# Altium project v7-9B-Bump.PrjPcb
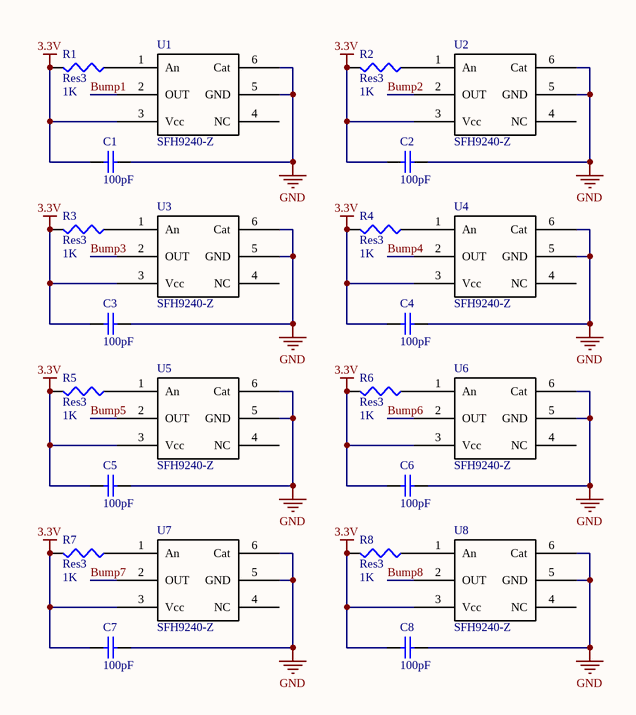
[diagram p0: Sensors.SchDoc]
4 sheets, 70 parts. Net scope: global (net labels, ports and power ports of the same name join across sheets).
Board file: v7-9B-Bump.PcbDoc
Sheets:
  Sensors.SchDoc
  motorEncoder.SchDoc
  Header.SchDoc
  LineCliffSensors.SchDoc

## Sheet Sensors.SchDoc
size A

### Parts
C1  value 100pF  [CAPC1005L]  (hidden comment: Cap Semi)
C2  value 100pF  [CAPC1005L]  (hidden comment: Cap Semi)
C3  value 100pF  [CAPC1005L]  (hidden comment: Cap Semi)
C4  value 100pF  [CAPC1005L]  (hidden comment: Cap Semi)
C5  value 100pF  [CAPC1005L]  (hidden comment: Cap Semi)
C6  value 100pF  [CAPC1005L]  (hidden comment: Cap Semi)
C7  value 100pF  [CAPC1005L]  (hidden comment: Cap Semi)
C8  value 100pF  [CAPC1005L]  (hidden comment: Cap Semi)
R1  Res3  value 1K  [RESC1608L]
R2  Res3  value 1K  [RESC1608L]
R3  Res3  value 1K  [RESC1608L]
R4  Res3  value 1K  [RESC1608L]
R5  Res3  value 1K  [RESC1608L]
R6  Res3  value 1K  [RESC1608L]
R7  Res3  value 1K  [RESC1608L]
R8  Res3  value 1K  [RESC1608L]
U1  SFH9240-Z  [SFH9240-Z]
U2  SFH9240-Z  [SFH9240-Z]
U3  SFH9240-Z  [SFH9240-Z]
U4  SFH9240-Z  [SFH9240-Z]
U5  SFH9240-Z  [SFH9240-Z]
U6  SFH9240-Z  [SFH9240-Z]
U7  SFH9240-Z  [SFH9240-Z]
U8  SFH9240-Z  [SFH9240-Z]

### Nets
3.3V: C1.2 C2.2 C3.2 C4.2 C5.2 C6.2 C7.2 C8.2 R1.2 R2.2 R3.2 R4.2 R5.2 R6.2 R7.2 R8.2 U1.3(Vcc) U2.3(Vcc) U3.3(Vcc) U4.3(Vcc) U5.3(Vcc) U6.3(Vcc) U7.3(Vcc) U8.3(Vcc)
GND: C1.1 C2.1 C3.1 C4.1 C5.1 C6.1 C7.1 C8.1 U1.5(GND) U1.6(Cat) U2.5(GND) U2.6(Cat) U3.5(GND) U3.6(Cat) U4.5(GND) U4.6(Cat) U5.5(GND) U5.6(Cat) U6.5(GND) U6.6(Cat) U7.5(GND) U7.6(Cat) U8.5(GND) U8.6(Cat)
Bump1: U1.2(OUT)
Bump2: U2.2(OUT)
Bump3: U3.2(OUT)
Bump4: U4.2(OUT)
Bump5: U5.2(OUT)
Bump6: U6.2(OUT)
Bump7: U7.2(OUT)
Bump8: U8.2(OUT)
NetR1_1: R1.1 U1.1(An)
NetR2_1: R2.1 U2.1(An)
NetR3_1: R3.1 U3.1(An)
NetR4_1: R4.1 U4.1(An)
NetR5_1: R5.1 U5.1(An)
NetR6_1: R6.1 U6.1(An)
NetR7_1: R7.1 U7.1(An)
NetR8_1: R8.1 U8.1(An)

Not connected (* = marked no-connect by the designer): U1 4(NC); U2 4(NC); U3 4(NC); U4 4(NC); U5 4(NC); U6 4(NC); U7 4(NC); U8 4(NC)

### Library data of the parts
C1-C8 = Cap Semi: Capacitor (Semiconductor SIM Model); Published: 8-Jun-2000; LatestRevisionDate: 29-May-2009; LatestRevisionNote: IPC-7351 Footprint Added.; PackageReference: C1206; Publisher: Altium Limited; PackageDescription: Chip Capacitor
R1-R8 = Res3: Resistor; Published: 8-Jun-2000; LatestRevisionDate: 29-May-2009; LatestRevisionNote: IPC-7351 Footprint Added.; PackageReference: J1-0603; Publisher: Altium Limited; PackageDescription: Chip Resistor

## Sheet motorEncoder.SchDoc
size A
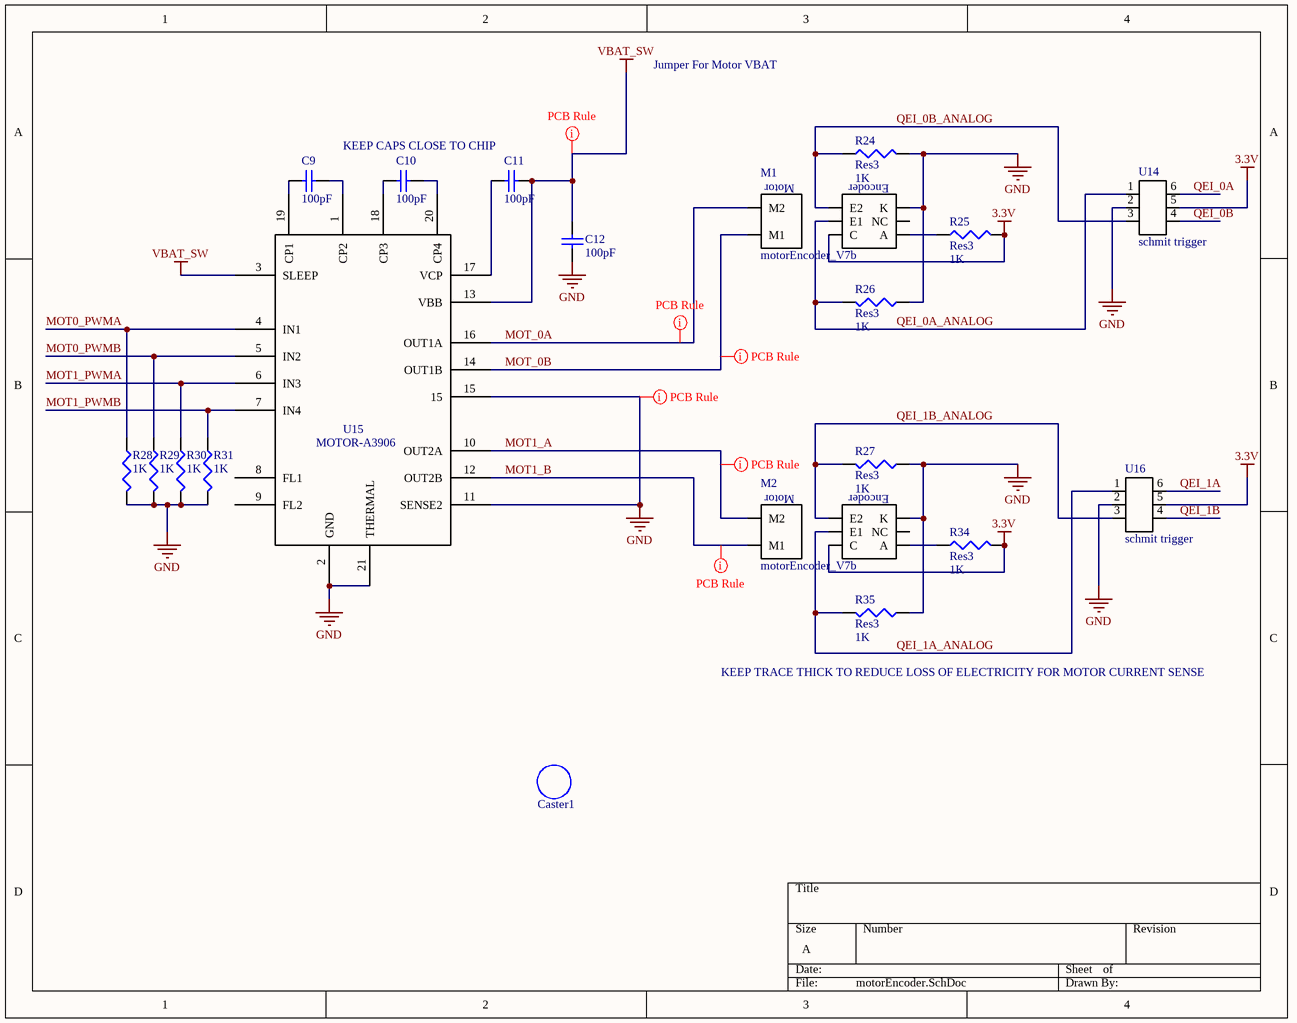
[diagram p1: motorEncoder.SchDoc]

### Parts
C9  value 100pF  [CAPC1005L]  (hidden comment: Cap Semi)
C10  value 100pF  [CAPC1005L]  (hidden comment: Cap Semi)
C11  value 100pF  [CAPC1005L]  (hidden comment: Cap Semi)
C12  value 100pF  [CAPC1005L]  (hidden comment: Cap Semi)
Caster1  non connect  [3/4"CASTER2]  (value not drawn)
M1  motorEncoder_V7b  [motorEncoder_V7b]
M2  motorEncoder_V7b  [motorEncoder_V7b]
R24  Res3  value 1K  [RESC1608L]
R25  Res3  value 1K  [RESC1608L]
R26  Res3  value 1K  [RESC1608L]
R27  Res3  value 1K  [RESC1608L]
R28  value 1K  [RESC1608L]  (hidden comment: Res3)
R29  value 1K  [RESC1608L]  (hidden comment: Res3)
R30  value 1K  [RESC1608L]  (hidden comment: Res3)
R31  value 1K  [RESC1608L]  (hidden comment: Res3)
R34  Res3  value 1K  [RESC1608L]
R35  Res3  value 1K  [RESC1608L]
U14  schmit trigger  [DCK(R-PDSO-C6)]
U15  MOTOR-A3906  [QFN-20]
U16  schmit trigger  [DCK(R-PDSO-C6)]

### Nets
3.3V: M1.C M2.C R25.2 R34.2 U14.5 U16.5
GND: C12.1 M1.K M2.K R24.2 R26.1 R27.1 R28.2 R29.2 R30.2 R31.2 R35.1 U14.2 U15.2(GND) U15.11(SENSE2) U15.15 U15.21(THERMAL) U16.2
VBAT_SW: C11.1 C12.2 U15.3(SLEEP) U15.13(VBB)
MOT0_PWMA: R28.1 U15.4(IN1)
MOT0_PWMB: R29.1 U15.5(IN2)
MOT1_A: M2.M2 U15.10(OUT2A)
MOT1_B: M2.M1 U15.12(OUT2B)
MOT1_PWMA: R30.1 U15.6(IN3)
MOT1_PWMB: R31.1 U15.7(IN4)
MOT_0A: M1.M2 U15.16(OUT1A)
MOT_0B: M1.M1 U15.14(OUT1B)
QEI_0A: U14.6
QEI_0A_ANALOG: M1.E1 R26.2 U14.1
QEI_0B: U14.4
QEI_0B_ANALOG: M1.E2 R24.1 U14.3
QEI_1A: U16.6
QEI_1A_ANALOG: M2.E1 R35.2 U16.1
QEI_1B: U16.4
QEI_1B_ANALOG: M2.E2 R27.2 U16.3
NetC9_1: C9.1 U15.19(CP1)
NetC9_2: C9.2 U15.1(CP2)
NetC10_1: C10.1 U15.18(CP3)
NetC10_2: C10.2 U15.20(CP4)
NetC11_2: C11.2 U15.17(VCP)
NetM1_A: M1.A R25.1
NetM2_A: M2.A R34.1

Not connected (* = marked no-connect by the designer): M1 NC; M2 NC; U15 8(FL1) 9(FL2)

### Layout directives
rule Width Constraint [Pref Width = 20mil    Min Width = 10mil    Max Width = 25mil]: GND, MOT1_A, MOT1_B, MOT_0A, MOT_0B, VBAT_SW

### Notes on the sheet
- Jumper For Motor VBAT
- KEEP CAPS CLOSE TO CHIP
- KEEP TRACE THICK TO REDUCE LOSS OF ELECTRICITY FOR MOTOR CURRENT SENSE
- (in symbol motorEncoder_V7b) Motor; Encoder

### Library data of the parts
C9-C12 = Cap Semi: Capacitor (Semiconductor SIM Model); Published: 8-Jun-2000; LatestRevisionDate: 29-May-2009; LatestRevisionNote: IPC-7351 Footprint Added.; PackageReference: C1206; Publisher: Altium Limited; PackageDescription: Chip Capacitor
Caster1 = Caster 3/4in: This is just a space saver to get the caster onto the pcb
R24-R31 R34 R35 = Res3: Resistor; Published: 8-Jun-2000; LatestRevisionDate: 29-May-2009; LatestRevisionNote: IPC-7351 Footprint Added.; PackageReference: J1-0603; Publisher: Altium Limited; PackageDescription: Chip Resistor

## Sheet Header.SchDoc
size A
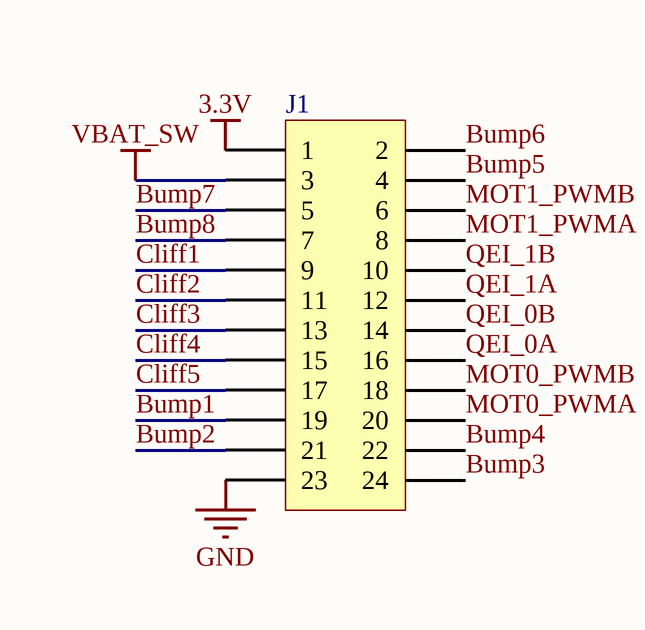
[diagram p2: Header.SchDoc]

### Parts
J1  Header 12X2  [HDR2X12]  (value not drawn)

### Nets
3.3V: J1.1
GND: J1.23
VBAT_SW: J1.3
Bump1: J1.19
Bump2: J1.21
Bump3: J1.24
Bump4: J1.22
Bump5: J1.4
Bump6: J1.2
Bump7: J1.5
Bump8: J1.7
Cliff1: J1.9
Cliff2: J1.11
Cliff3: J1.13
Cliff4: J1.15
Cliff5: J1.17
MOT0_PWMA: J1.20
MOT0_PWMB: J1.18
MOT1_PWMA: J1.8
MOT1_PWMB: J1.6
QEI_0A: J1.16
QEI_0B: J1.14
QEI_1A: J1.12
QEI_1B: J1.10

### Library data of the parts
J1 = Header 12X2: Header, 12-Pin, Dual row; LatestRevisionDate: 17-Jul-2002; LatestRevisionNote: Re-released for DXP Platform.; Publisher: Altium Limited

## Sheet LineCliffSensors.SchDoc
size A
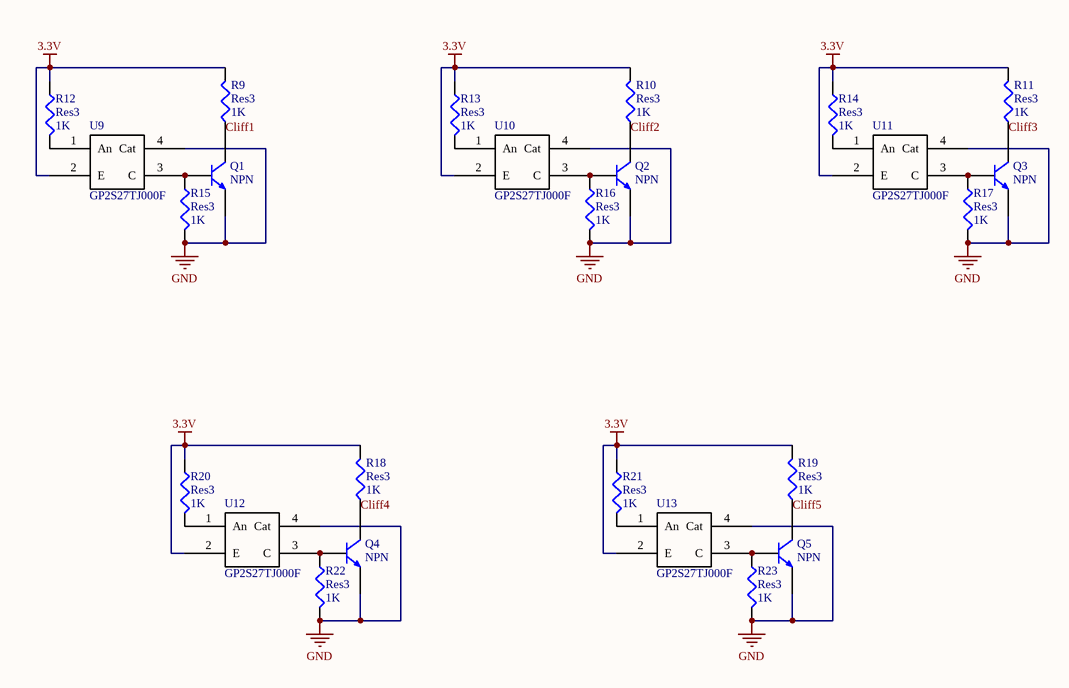
[diagram p3: LineCliffSensors.SchDoc]

### Parts
Q1  NPN  [SOT-23]
Q2  NPN  [SOT-23]
Q3  NPN  [SOT-23]
Q4  NPN  [SOT-23]
Q5  NPN  [SOT-23]
R9  Res3  value 1K  [RESC1608L]
R10  Res3  value 1K  [RESC1608L]
R11  Res3  value 1K  [RESC1608L]
R12  Res3  value 1K  [RESC1608L]
R13  Res3  value 1K  [RESC1608L]
R14  Res3  value 1K  [RESC1608L]
R15  Res3  value 1K  [RESC1608L]
R16  Res3  value 1K  [RESC1608L]
R17  Res3  value 1K  [RESC1608L]
R18  Res3  value 1K  [RESC1608L]
R19  Res3  value 1K  [RESC1608L]
R20  Res3  value 1K  [RESC1608L]
R21  Res3  value 1K  [RESC1608L]
R22  Res3  value 1K  [RESC1608L]
R23  Res3  value 1K  [RESC1608L]
U9  GP2S27TJ000F  [GP2S27J0000F]
U10  GP2S27TJ000F  [GP2S27J0000F]
U11  GP2S27TJ000F  [GP2S27J0000F]
U12  GP2S27TJ000F  [GP2S27J0000F]
U13  GP2S27TJ000F  [GP2S27J0000F]

### Nets
3.3V: R9.2 R10.2 R11.2 R12.1 R13.1 R14.1 R18.2 R19.2 R20.1 R21.1 U9.2(E) U10.2(E) U11.2(E) U12.2(E) U13.2(E)
GND: Q1.2(E) Q2.2(E) Q3.2(E) Q4.2(E) Q5.2(E) R15.2 R16.2 R17.2 R22.2 R23.2 U9.4(Cat) U10.4(Cat) U11.4(Cat) U12.4(Cat) U13.4(Cat)
Cliff1: Q1.3(C) R9.1
Cliff2: Q2.3(C) R10.1
Cliff3: Q3.3(C) R11.1
Cliff4: Q4.3(C) R18.1
Cliff5: Q5.3(C) R19.1
NetQ1_1: Q1.1(B) R15.1 U9.3(C)
NetQ2_1: Q2.1(B) R16.1 U10.3(C)
NetQ3_1: Q3.1(B) R17.1 U11.3(C)
NetQ4_1: Q4.1(B) R22.1 U12.3(C)
NetQ5_1: Q5.1(B) R23.1 U13.3(C)
NetR12_2: R12.2 U9.1(An)
NetR13_2: R13.2 U10.1(An)
NetR14_2: R14.2 U11.1(An)
NetR20_2: R20.2 U12.1(An)
NetR21_2: R21.2 U13.1(An)

### Library data of the parts
R9-R23 = Res3: Resistor; Published: 8-Jun-2000; LatestRevisionDate: 29-May-2009; LatestRevisionNote: IPC-7351 Footprint Added.; PackageReference: J1-0603; Publisher: Altium Limited; PackageDescription: Chip Resistor

## Nets that join several sheets
3.3V: Sensors (24 pins), motorEncoder (6 pins), Header (J1.1), LineCliffSensors (15 pins)
GND: Sensors (24 pins), motorEncoder (17 pins), Header (J1.23), LineCliffSensors (15 pins)
VBAT_SW: motorEncoder (C11.1 C12.2 U15.3 U15.13), Header (J1.3)
Bump1: Sensors (U1.2), Header (J1.19)
Bump2: Sensors (U2.2), Header (J1.21)
Bump3: Sensors (U3.2), Header (J1.24)
Bump4: Sensors (U4.2), Header (J1.22)
Bump5: Sensors (U5.2), Header (J1.4)
Bump6: Sensors (U6.2), Header (J1.2)
Bump7: Sensors (U7.2), Header (J1.5)
Bump8: Sensors (U8.2), Header (J1.7)
Cliff1: Header (J1.9), LineCliffSensors (Q1.3 R9.1)
Cliff2: Header (J1.11), LineCliffSensors (Q2.3 R10.1)
Cliff3: Header (J1.13), LineCliffSensors (Q3.3 R11.1)
Cliff4: Header (J1.15), LineCliffSensors (Q4.3 R18.1)
Cliff5: Header (J1.17), LineCliffSensors (Q5.3 R19.1)
MOT0_PWMA: motorEncoder (R28.1 U15.4), Header (J1.20)
MOT0_PWMB: motorEncoder (R29.1 U15.5), Header (J1.18)
MOT1_PWMA: motorEncoder (R30.1 U15.6), Header (J1.8)
MOT1_PWMB: motorEncoder (R31.1 U15.7), Header (J1.6)
QEI_0A: motorEncoder (U14.6), Header (J1.16)
QEI_0B: motorEncoder (U14.4), Header (J1.14)
QEI_1A: motorEncoder (U16.6), Header (J1.12)
QEI_1B: motorEncoder (U16.4), Header (J1.10)